# EasyEDA Pro project rtl_sdr_v1.eprj, board PCB2
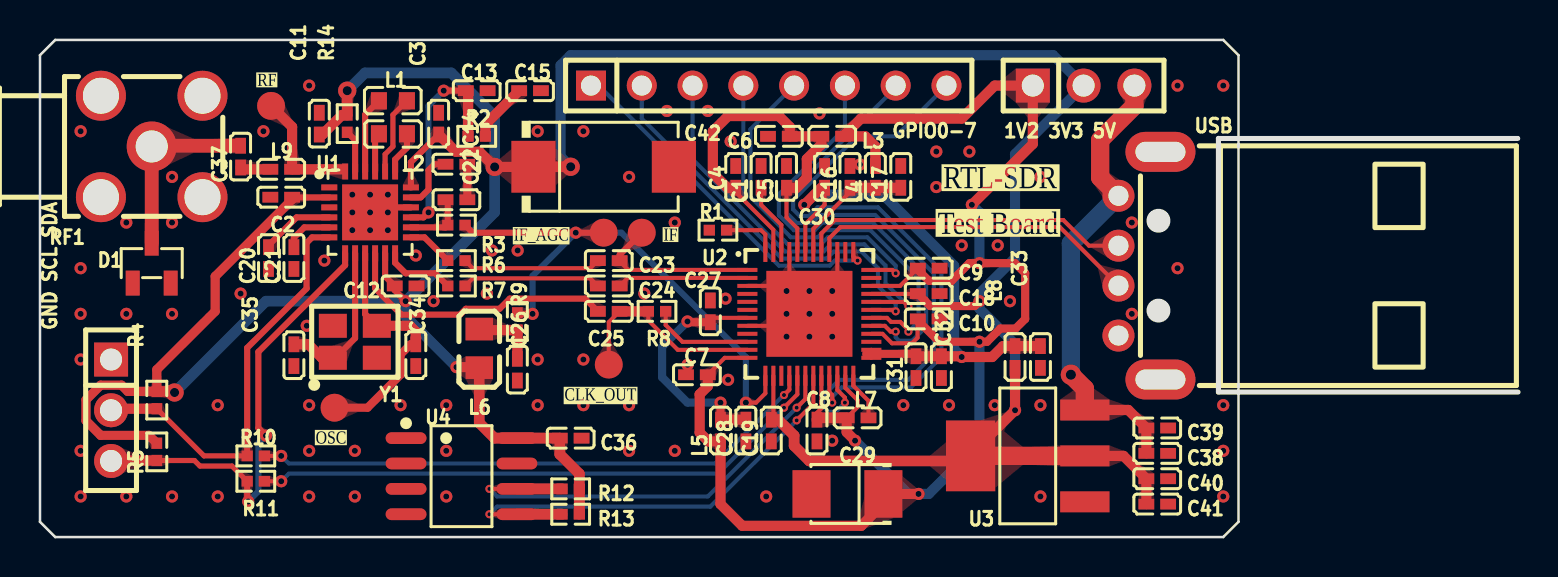
[diagram p5: board, top side]
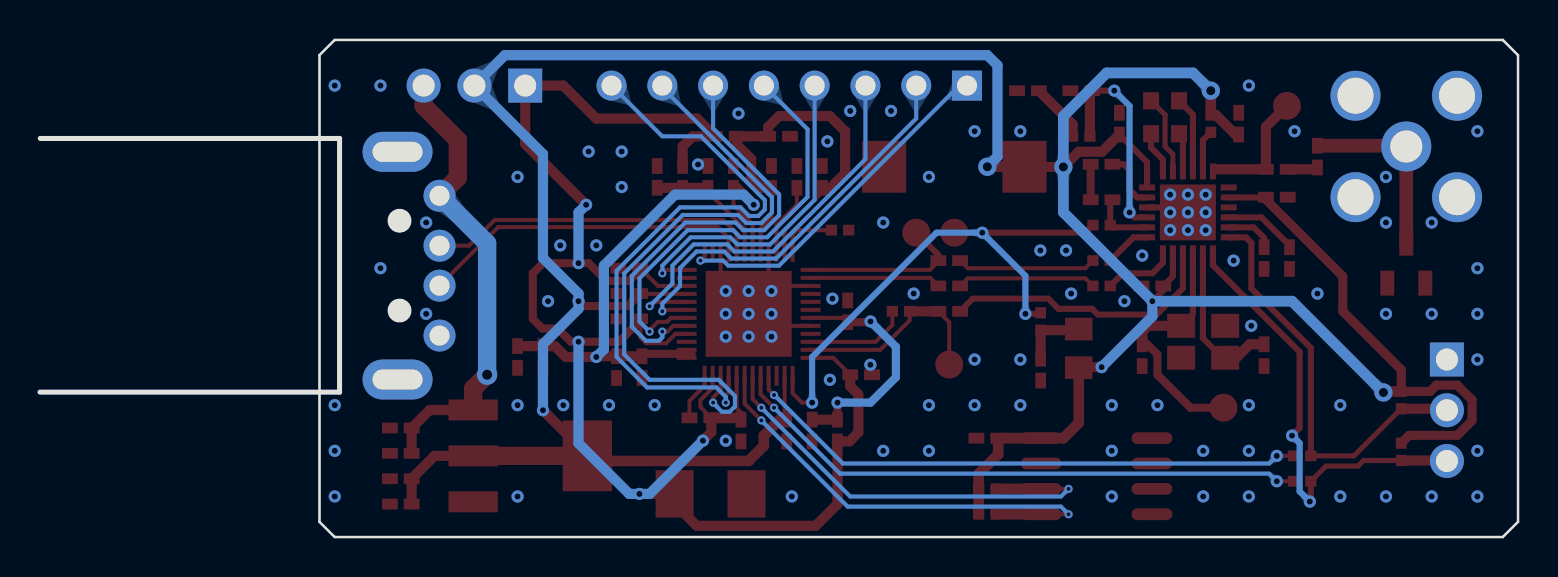
[diagram p6: board, bottom side, seen from below]

Outline 73.92 x 24.89 mm; copper layers: Top Layer, Bottom Layer. Coordinates in mm from the lower left corner of the outline.
Outline path: 0,24.13 0,0.76 0.76,0 59.18,0 59.94,0.76 59.94,24.13 59.18,24.89 0.76,24.89 0,24.13
Stack: Top Layer 0.035mm / Dielectric1 1.51mm FR4 er 4.5 / Bottom Layer 0.035mm

## Design rules (mm)
spacing safeClearance (default): track to track 0.152, other pairs 0.102 to 0.3
track width trackWidth (default): min 0.127, default 0.254, max 2.54
differential pair differentialPair (default): width min 0.127, default 0.254, max 2.54; gap min 0.152, default 0.152
via viaSize (default): diameter min 0.406, default 0.61, max 10; hole min 0.203, default 0.305, max 5.999

## Placement (name value [footprint] x y rotation side)
1V2 3V3 5V  A2541WV-3P  [HDR-TH_3P-P2.54-V-M]  52.2 22.61 0 top
C1  100nF  [C0402]  36.07 18.03 90 top
C2  100nF  [C0402]  12.06 17.02 180 top
C3  100nF  [C0402]  19.94 20.7 90 top
C4  100nF  [C0402]  34.8 18.03 270 top
C5  100nF  [C0402]  37.34 18.03 270 top
C6  2.2uF  [C0402]  36.96 20.07 0 top
C7  100nF  [C0402]  32.86 8.13 180 top
C8  100nF  [C0402]  38.86 5.33 270 top
C9  100nF  [C0402]  44.45 13.46 0 top
C10  100nF  [C0402]  44.45 10.92 0 top
C11  10nF  [C0402]  13.97 20.7 270 top
C12  10nF  [C0402]  18.29 12.57 180 top
C13  330pF  [C0402]  21.84 22.35 180 top
C14  100nF  [C0402]  20.83 18.67 180 top
C15  6.8nF  [C0402]  24.51 22.35 180 top
C16  100nF  [C0402]  40.51 18.03 270 top
C17  2.2uF  [C0402]  43.05 18.03 270 top
C18  100nF  [C0402]  44.45 12.19 0 top
C19  100nF  [C0402]  36.58 5.33 270 top
C20  1uF  [C0402]  11.43 13.97 90 top
C21  100nF  [C0402]  12.7 13.97 270 top
C22  100nF  [C0402]  20.83 16.89 0 top
C23  100nF  [C0402]  28.45 13.84 0 top
C24  100nF  [C0402]  28.45 12.57 0 top
C25  100nF  [C0402]  28.45 11.3 0 top
C26  100nF  [C0402]  23.88 8.38 90 top
C27  100nF  [C0402]  33.53 11.3 270 top
C28  2.2uF  [C0402]  35.31 5.33 90 top
C29  22uF  [CAP-SMD_L3.5-W2.8-FD]  40.39 2.16 180 top
C30  100nF  [C0402]  39.24 18.03 270 top
C31  100nF  [C0402]  43.81 8.51 270 top
C32  10uF  [C0402]  45.08 8.51 270 top
C33  2.2uF  [C0402]  50.04 9.02 90 top
C34  27pF  [C0402]  18.8 9.11 270 top
C35  27pF  [C0402]  12.7 9.11 90 top
C36  100nF  [C0402]  26.54 4.95 0 top
C37  10nF  [C0402]  10.03 19.05 270 top
C38  10uF  [C0402]  55.88 4.19 180 top
C39  100nF  [C0402]  55.88 5.46 180 top
C40  10uF  [C0402]  55.88 2.92 180 top
C41  100nF  [C0402]  55.88 1.65 180 top
C42  220uF  [CAP-SMD_L7.3-W4.3-R-RD]  28.19 18.54 180 top
D1  BAV99LT1G  [SOT-23-3_L2.9-W1.3-P1.90-LS2.4-BR]  5.59 13.72 270 top
GND SCL SDA  A2541WV-3P  [HDR-TH_3P-P2.54-V-M]  3.56 6.35 270 top
GPIO0-7  B-2100S08P-A110  [HDR-TH_8P-P2.54-V-M]  36.45 22.61 0 top
L1  150nH  [L0603]  17.65 21.84 0 top
L2  150nH  [L0603]  17.65 20.19 180 top
L3  26Ω@100MHz  [L0402]  39.62 20.07 0 top
L4  26Ω@100MHz  [L0402]  41.78 18.03 90 top
L5  26Ω@100MHz  [L0402]  34.04 5.33 270 top
L6  1.8uH  [L0805]  21.97 9.45 90 top
L7  4.7uH  [L0402]  40.89 5.97 180 top
L8  26Ω@100MHz  [L0402]  48.77 9.02 270 top
L9  4.7nH  [L0402]  12.06 18.41 0 top
NOREF  -  [Pad_e544]  28.19 15.24 0 top
NOREF#2  -  [Pad_e529]  11.56 21.59 0 top
NOREF#3  -  [Pad_e538]  14.73 6.48 0 top
NOREF#4  -  [Pad_e540]  28.45 8.64 0 top
NOREF#5  -  [Pad_e542]  30.1 15.24 0 top
R1  10kΩ  [R0402]  33.91 15.37 0 top
R2  1.8kΩ  [R0402]  21.84 20.07 180 top
R3  10kΩ  [R0402]  20.83 15.62 0 top
R4  4.7kΩ  [R0402]  5.84 6.86 90 top
R5  4.7kΩ  [R0402]  5.84 4.27 90 top
R6  220Ω  [R0402]  20.83 13.84 0 top
R7  220Ω  [R0402]  20.83 12.57 0 top
R8  1MΩ  [R0402]  30.86 11.3 0 top
R9  1kΩ  [R0402]  23.88 10.79 270 top
R10  220Ω  [R0402]  10.79 4.06 0 top
R11  220Ω  [R0402]  10.79 2.79 0 top
R12  4.7kΩ  [R0402]  26.54 2.41 0 top
R13  4.7kΩ  [R0402]  26.54 1.14 0 top
R14  5.6Ω  [R0402]  15.37 20.7 270 top
RF1  DOSIN-806-0001  [CONN-TH_DOSIN-806-0001]  5.59 19.56 180 top
U1  -  [VQFN-24_L4.0-W4.0-P0.50-TL-EP2.8]  16.51 16.26 0 top
U2  -  [QFN-48_L6.0-W6.0-P0.40-BL-EP4.3]  38.48 11.18 270 top
U3  AMS1117-3.3  [SOT-223_L6.5-W3.5-P2.30-LS7.0-BR]  49.4 4.06 0 top
U4  M24C02-RMN6TP  [SOIC-8_L4.9-W3.9-P1.27-LS6.0-BL]  21.08 3.05 270 top
USB  USB-05  [USB-A-TH_48037-0001]  54.99 13.59 90 top
Y1  -  [28.8MHz]  15.75 9.78 0 top

## Footprints (pads in the part's own frame, mm; a bottom-side part is the same pattern mirrored in y, then rotated)
28.8MHz
  custom 1.4x1.2 smd: 1(-1.1,-0.8)
  rect 1.4x1.2 smd: 2(1.1,-0.8) 3(1.1,0.8) 4(-1.1,0.8)
C0402
  rect 0.79x0.54 smd: 1(-0.545,0) 2(0.545,0)
CAP-SMD_L3.5-W2.8-FD
  rect 1.9x2.376 smd: 1(-1.798,0) 2(1.798,0)
CAP-SMD_L7.3-W4.3-R-RD
  rect 2.208x2.592 smd: 1(3.511,0) 2(-3.511,0)
CONN-TH_DOSIN-806-0001
  round 2.5 hole 1.8: 1(-2.54,-2.54) 2(-2.54,2.54) 3(2.54,2.54) 4(2.54,-2.54)
  round 2.5 hole 1.6: 5(0,0)
HDR-TH_3P-P2.54-V-M
  rect 1.7x1.7 hole 1.1: 1(-2.54,0)
  round 1.7 hole 1.1: 2(0,0) 3(2.54,0)
HDR-TH_8P-P2.54-V-M
  rect 1.5x1.5 hole 1: 1(-8.89,0)
  round 1.5 hole 1: 2(-6.35,0) 3(-3.81,0) 4(-1.27,0) 5(1.27,0) 6(3.81,0) 7(6.35,0) 8(8.89,0)
L0402
  rect 0.79x0.54 smd: 1(-0.545,0) 2(0.545,0)
L0603
  rect 0.8x0.864 smd: 1(-0.7,0) 2(0.7,0)
L0805
  rect 1.133x1.377 smd: 1(-0.966,0) 2(0.966,0)
Pad_e529
  round 1.397 smd: RF(0,0)
Pad_e538
  round 1.397 smd: OSC(0,0)
Pad_e540
  round 1.397 smd: CLKOUT(0,0)
Pad_e542
  round 1.397 smd: IF(0,0)
Pad_e544
  round 1.397 smd: IFAGC(0,0)
QFN-48_L6.0-W6.0-P0.40-BL-EP4.3
  rect 0.2x1 smd: 1(-2.2,-3.1) 2(-1.8,-3.1) 3(-1.4,-3.1) 4(-1,-3.1) 5(-0.6,-3.1) 6(-0.2,-3.1) 7(0.2,-3.1) 8(0.6,-3.1) 9(1,-3.1) 10(1.4,-3.1) 11(1.8,-3.1) 12(2.2,-3.1) 25(2.2,3.1) 26(1.8,3.1) 27(1.4,3.1) 28(1,3.1) 29(0.6,3.1) 30(0.2,3.1) 31(-0.2,3.1) 32(-0.6,3.1) 33(-1,3.1) 34(-1.4,3.1) 35(-1.8,3.1) 36(-2.2,3.1)
  rect 1x0.2 smd: 13(3.1,-2.2) 14(3.1,-1.8) 15(3.1,-1.4) 16(3.1,-1) 17(3.1,-0.6) 18(3.1,-0.2) 19(3.1,0.2) 20(3.1,0.6) 21(3.1,1) 22(3.1,1.4) 23(3.1,1.8) 24(3.1,2.2) 37(-3.1,2.2) 38(-3.1,1.8) 39(-3.1,1.4) 40(-3.1,1) 41(-3.1,0.6) 42(-3.1,0.2) 43(-3.1,-0.2) 44(-3.1,-0.6) 45(-3.1,-1) 46(-3.1,-1.4) 47(-3.1,-1.8) 48(-3.1,-2.2)
  rect 4.3x4.3 smd: 49(-0.002,0.002)
R0402
  rect 0.566x0.54 smd: 1(-0.433,0) 2(0.433,0)
SOIC-8_L4.9-W3.9-P1.27-LS6.0-BL
  oval 0.588x2.045 smd: 1(-1.905,-2.772) 2(-0.635,-2.772) 3(0.635,-2.772) 4(1.905,-2.772) 5(1.905,2.772) 6(0.635,2.772) 7(-0.635,2.772) 8(-1.905,2.772)
SOT-23-3_L2.9-W1.3-P1.90-LS2.4-BR
  rect 1.25x0.7 smd: 1(1,-0.95) 2(1,0.95) 3(-1,0)
SOT-223_L6.5-W3.5-P2.30-LS7.0-BR
  rect 2.465x1.05 smd: 1(2.857,-2.3) 2(2.857,0) 3(2.857,2.3)
  rect 2.465x3.54 smd: 4(-2.857,0)
USB-A-TH_48037-0001
  round 1.6 hole 1: 1(3.5,1.05) 2(1,1.05) 3(-1,1.05) 4(-3.5,1.05)
  oval 2x3.5 hole 1x2.5: 5(-5.7,-1.05) 6(5.7,-1.05)
VQFN-24_L4.0-W4.0-P0.50-TL-EP2.8
  rect 0.8x0.3 smd: 1(-2.042,1.25) 2(-2.042,0.75) 3(-2.042,0.25) 4(-2.042,-0.25) 5(-2.042,-0.75) 6(-2.042,-1.25) 13(2.042,-1.25) 14(2.042,-0.75) 15(2.042,-0.25) 16(2.042,0.25) 17(2.042,0.75) 18(2.042,1.25)
  rect 0.3x0.8 smd: 7(-1.25,-2.048) 8(-0.75,-2.048) 9(-0.25,-2.048) 10(0.249,-2.048) 11(0.75,-2.048) 12(1.25,-2.048) 19(1.25,2.048) 20(0.75,2.048) 21(0.249,2.048) 22(-0.25,2.048) 23(-0.75,2.048) 24(-1.25,2.048)
  rect 2.8x2.8 smd: 25(-0.001,-0.001)

## Nets
1V2: 1V2 3V3 5V.1 C7.1 C8.1 C9.1 C10.1 C29.1 L3.2 L4.2 L5.2 L7.2 U2.12 U2.20 U2.23 U2.28 U2.34
3V3: 1V2 3V3 5V.2 C2.1 C3.1 C11.2 C12.2 C18.1 C19.1 C36.1 C40.2 C41.2 C42.1 L6.1 L8.2 R4.2 R5.2 R12.2 R13.2 R14.1 U1.2 U1.11 U1.18 U2.14 U2.33 U3.2 U3.4 U4.8
5V: 1V2 3V3 5V.3 C38.2 C39.2 U3.3 USB.1
GND: C1.2 C2.2 C3.2 C4.1 C5.1 C6.1 C7.2 C8.2 C9.2 C10.2 C11.1 C12.1 C13.1 C14.1 C15.1 C16.1 C17.1 C18.2 C19.2 C20.1 C21.2 C22.2 C26.1 C27.1 C28.1 C29.2 C30.1 C31.2 C32.2 C33.1 C34.2 C35.1 C36.2 C38.1 C39.1 C40.1 C41.1 C42.2 D1.1 D1.2 GND SCL SDA.1 R1.1 RF1.1 RF1.2 RF1.3 RF1.4 U1.16 U1.25 U2.3 U2.8 U2.39 U2.45 U2.49 U3.1 U4.1 U4.2 U4.3 U4.4 U4.7 USB.4 Y1.2 Y1.4
VDD_PLL: C27.2 C28.2 L5.1 U2.7
VDDA12: C4.2 C5.2 C6.2 L3.1 U2.44 U2.47
VDDA33: C30.2 C31.1 C32.1 C33.2 L8.1 U2.25 U2.26 U2.43
CLK_OUT: C25.2 NOREF#4.CLKOUT R8.1 U2.11
GPIO0: GPIO0-7.1 U2.37
GPIO1: GPIO0-7.2 U2.31
GPIO2: GPIO0-7.3 U2.32
GPIO3: GPIO0-7.4 U2.36
GPIO4: GPIO0-7.5 U2.30
GPIO5: GPIO0-7.6 U2.29
GPIO6: GPIO0-7.7 U2.22
GPIO7: GPIO0-7.8 U2.21
IF_AGC: NOREF.IFAGC R3.2 R9.1 U2.13
IF_IN: C24.2 U2.2
IF_IP: C23.2 NOREF#5.IF U2.1
RF_IN: L9.2 NOREF#2.RF U1.24
ROM_SCL: R12.1 U2.18 U4.6
ROM_SDA: R13.1 U2.19 U4.5
T_SCL: GND SCL SDA.2 R4.1 R10.1 U1.6
T_SDA: GND SCL SDA.3 R5.1 R11.1 U1.7
USB_DM: U2.41 USB.2
USB_DP: U2.40 USB.3
UVDDA: C16.2 C17.2 L4.1 U2.42
XTAL_I: C35.2 U1.8 Y1.1
XTAL_O: C34.1 NOREF#3.OSC U1.9 Y1.3
$1N1594: C37.1 D1.3 RF1.5
$1N1930: C37.2 L9.1
$1N6838: C21.1 U1.5
$1N6851: C20.2 U1.4
$1N11372: L1.1 U1.22
$1N11392: L1.2 U1.20
$1N12305: L2.1 U1.19
$1N12306: L2.2 U1.21
$1N15211: C23.1 R6.2
$1N15347: C24.1 R7.2
$1N15700: C22.1 R3.1 U1.14
$1N16619: C13.2 R2.2 U1.15
$1N16902: C14.2 U1.17
$1N17181: C15.2 R2.1
$1N18448: R6.1 U1.13
$1N18481: R7.1 U1.12
$1N21853: C25.1 U1.10
$1N26222: R8.2 U2.10
$1N27944: R10.2 U2.16
$1N27983: R11.2 U2.17
$1N40591: R1.2 U2.48
$1N40849: C1.1 U2.46
$1N44263: C26.2 L6.2 R9.2
$1N51858: L7.1 U2.24
$1N92956: R14.2 U1.23

Pads without a net: U1 1 3; U2 4 5 6 9 15 27 35 38; USB 5 6

## Via types
v1: diameter 0.61, hole 0.305, Top Layer to Bottom Layer, 116 vias
v2: diameter 1.016, hole 0.508, Top Layer to Bottom Layer, 1 via
v3: diameter 0.914, hole 0.457, Top Layer to Bottom Layer, 4 vias
v4: diameter 0.406, hole 0.203, Top Layer to Bottom Layer, 14 vias

## Routing (per net, layer and track width the routed paths; a pad name or vN(x,y) marks a point on that pad's centre or on a via; arc(x,y) is an arc through that point)
1V2: length 86.9
  Top Layer w0.203: U2.28 42.14,10.18 42.61,9.7 43.61,9.7 43.89,9.98 43.89,10.83 43.9,10.84 ; U2.12 34.25,8.98 C7.1 ; U2.34 43.02,12.58 43.87,13.42 ; U2.20 39.08,6.44 38.86,6.22 C8.1 ; L7.2 40.89,6.51 40.89,6.86 40.28,7.47 U2.23
  Top Layer w0.406: 43.9,13.46 43.87,13.42 44.46,12.83 45.59,12.83 46.48,13.72 v1(46.99,13.72) 48.77,13.72 49.28,13.21 49.28,10.92 48.79,10.44 48.03,10.44 47.37,9.78 v1(46.99,9.78) 44.97,9.78 43.9,10.84
  Top Layer w0.508: C7.1 33.4,7.55 32.99,7.15 32.99,5.23 33.44,4.79 L5.2 34.04,1.65 35.12,0.56 41.08,0.56 42.18,1.67 C29.1 v1(43.94,2.16) ; L7.2 40.35,5.25 40.77,4.83 v1(40.77,4.83) ; v1(46.61,16.64) 49.66,19.68 1V2 3V3 5V.1 47.75,22.61 46.1,20.95 41.06,20.95 L3.2 41.27,20.07 41.78,19.56 L4.2
  Top Layer w0.533: L7.2 38.95,5.97 C8.1
  Bottom Layer w0.508: v1(46.61,16.64) 46.99,16.26 v1(46.99,13.72) ; v1(46.99,9.78) 46.99,4.7 44.45,2.16 v1(43.94,2.16) 43.43,2.16 v1(40.77,4.83)
3V3: length 177.1
  Top Layer w0.203: U2.33 43.89,12.18 43.9,12.19 ; U2.14 36.68,5.98
  Top Layer w0.305: C2.1 12.62,17.01 U1.2 ; v1(18.29,11.81) 17.74,12.36 C12.2 17.26,13.05 U1.11 ; C3.1 18.55,18.77 U1.18
  Top Layer w0.406: 43.9,12.19 44.24,11.85 44.24,11.85 44.53,11.57 46.75,11.57 v1(46.99,11.81)
  Top Layer w0.457: R5.2 5.45,5.09 3.04,5.09 2.3,5.83 2.3,6.87 3.04,7.61 4.08,7.61 4.39,7.29 R4.2 5.84,8.38 8.76,11.3 8.76,13.05 12.62,16.91 12.62,17.01
  Top Layer w0.508: C42.1 24.67,18.53 v3(22.74,18.53) 21.98,19.29 20.8,19.29 C3.1 ; L8.2 v1(48.77,6.35) 46.55,4.13 U3.4 ; R14.1 15.1,21.13 14.13,20.16 C11.2 ; C41.2 C40.2 54.19,4.06 U3.2 ; 21.97,8.51 v1(20.83,8.51)
  Top Layer w0.533: R4.2 6.68,7.29 v3(6.73,7.24) ; v3(15.37,22.35) R14.1 ; U3.4 46.29,3.81 38.48,3.81 37.72,4.57 37.72,5.08 36.92,5.88 C19.1 ; R13.2 R12.2 26.98,3.17 26,4.14 C36.1 U4.8 22.73,4.95 21.97,5.71 21.97,8.51 ; v3(26.54,18.54) C42.1
  Top Layer w0.914: U3.4 U3.2
  Bottom Layer w0.508: v3(26.54,18.54) 26.03,19.05 26.03,23.62 26.54,24.13 50.67,24.13 1V2 3V3 5V.2 48.77,19.18 48.77,13.97 46.99,12.19 v1(46.99,11.81) 46.99,11.43 48.77,9.65 v1(48.77,6.35) ; v1(20.83,8.51) 18.29,11.05 v1(18.29,11.81)
  Bottom Layer w0.533: v3(15.37,22.35) 16.26,23.24 20.57,23.24 22.74,21.07 v3(22.74,18.53) 22.74,16.26 v1(18.29,11.81) 11.3,11.81 v3(6.73,7.24)
5V: length 23.3
  Top Layer w0.508: U3.3 54.43,6.36 C39.2 C38.2
  Top Layer w0.914: USB.1 53.03,18 53.03,19.88 54.74,21.59 1V2 3V3 5V.3 ; U3.3 52.26,7.43 v2(51.56,8.13)
  Bottom Layer w0.914: USB.1 51.56,14.71 v2(51.56,8.13)
GND: length 11.4
  Top Layer w0.203: U2.8 36.74,10.58 v1(37.34,11.18) ; U2.45 37.48,12.46 v1(37.34,12.32) 37.08,12.58 U2.3 ; U2.39 39.88,12.58 v1(39.63,12.32)
  Top Layer w0.305: U1.16 17.65,16.51 v1(17.4,16.26)
  Top Layer w0.406: C14.1 C22.2
  vias: v1(2.03,20.32) v1(2.03,13.46) v1(2.03,11.18) v1(2.03,8.89) v1(2.03,4.32) v1(2.03,2.03) v1(4.32,15.75) v1(4.32,11.18) v1(4.32,2.03) v1(6.6,18.03) v1(6.6,15.75) v1(6.6,11.18) v1(6.6,2.03) v1(8.89,6.6) v1(8.89,2.03) v1(10.03,12.19) v1(11.18,20.32) v1(13.34,10.58) v1(13.46,22.61) v1(13.46,6.6) v1(13.46,4.32) v1(13.46,2.03) v1(14.22,13.84) v1(15.62,17.14) v1(15.62,16.26) v1(15.62,15.37) v1(15.75,4.32) v1(15.75,2.03) v1(16.51,17.14) v1(16.51,16.26) v1(16.51,15.37) v1(17.4,17.14) v1(17.4,15.37) v1(18.03,6.6) v1(18.8,14.1) v1(19.68,11.81) v1(20.32,6.6) v1(20.32,4.32) v1(20.32,2.03) v1(22.35,12.19) v1(22.61,14.35) v1(23.89,14.35) v1(24.89,20.32) v1(24.89,8.89) v1(24.89,6.6) v1(27.18,20.32) v1(27.18,8.89) v1(27.18,6.6) v1(29.46,18.03) v1(29.46,6.6) v1(29.46,4.32) v1(30.23,12.19) v1(31.36,21.34) v1(31.75,15.75) v1(31.75,4.32) v1(32.39,8.63) v1(33.4,21.34) v1(34.29,11.94) v1(34.42,7.87) v1(34.54,19.81) v1(36.32,2.03) v1(37.34,10.03) v1(38.48,12.32) v1(38.48,11.18) v1(38.48,10.03) v1(38.99,21.21) v1(39.63,11.18) v1(39.63,10.03) v1(39.62,4.83) v1(41.01,18.66) v1(43.18,6.6) v1(44.83,19.3) v1(44.83,17.53) v1(45.47,6.6) v1(46.1,14.6) v1(46.48,19.3) v1(47.75,6.6) v1(47.9,14.6) v1(48.51,11.81) v1(50.04,18.03) v1(50.04,6.6) v1(50.04,2.03) v1(54.61,15.75) v1(54.61,11.18) v1(56.9,22.61) v1(56.9,13.46) v1(59.18,22.61) v1(59.18,6.6) v1(59.18,4.32) v1(59.18,2.03)
VDD_PLL: length 12
  Top Layer w0.203: U2.7 33.75,10.98 C27.2
  Top Layer w0.406: v1(32.39,10.79) 32.42,10.76 C27.2 ; v1(34.04,6.73) L5.1
  Top Layer w0.508: L5.1 C28.2
  Bottom Layer w0.406: v1(32.39,10.79) 31.11,9.52 31.11,8 32.39,6.73 v1(34.04,6.73)
VDDA12: length 21
  Top Layer w0.203: U2.47 36.68,15.39 34.8,17.27 C4.2 ; U2.44 37.88,15.46 37.34,16 C5.2
  Top Layer w0.508: C4.2 34.38,17.49 33.65,18.21 33.65,20.32 34.42,21.08 36.96,21.08 37.5,20.54 C6.2 L3.1 39.08,19.65 38.35,18.93 38.35,18 37.85,17.49 C5.2
VDDA33: length 28.2
  Top Layer w0.203: U2.25 U2.26 ; U2.43 38.28,15.67 39.24,16.64 C30.2
  Top Layer w0.406: 41.33,9.17 41.45,9.17 ; C31.1 43.69,9.17 41.58,9.17
  Top Layer w0.508: C33.2 L8.1 48.17,9.56 47.62,9.02 v1(46.1,9.02) 46.06,9.05 C32.1 C31.1 ; C30.2 39.08,17.49 v1(38.23,16.64)
  Bottom Layer w0.508: v1(46.1,9.02) 45.72,9.4 45.72,13.59 42.16,17.14 38.73,17.14 v1(38.23,16.64)
CLK_OUT: length 10.3
  Top Layer w0.203: C25.2 28.45,10.76 NOREF#4.CLKOUT ; R8.1 30.43,10.85 31.9,9.38 U2.11
  Top Layer w0.508: C25.2 R8.1
GPIO0: length 17.7
  Top Layer w0.203: U2.37 40.68,14.06 v4(40.89,13.84)
  Bottom Layer w0.203: GPIO0-7.1 27.95,22.61 36.96,13.59 39.5,13.59 39.75,13.84 v4(40.89,13.84)
GPIO1: length 20.6
  Top Layer w0.203: U2.31 42.73,11.38 v4(42.8,11.3)
  Bottom Layer w0.203: GPIO0-7.2 30.1,20.95 37.11,13.94 39.34,13.94 39.7,14.3 41.08,14.3 41.91,13.47 41.91,12.57 42.8,11.68 v4(42.8,11.3)
GPIO2: length 20.3
  Top Layer w0.203: v4(43.43,11.56) 43.21,11.78 U2.32
  Bottom Layer w0.203: v4(43.43,11.56) 42.29,12.7 42.29,13.6 41.23,14.66 39.55,14.66 39.2,14.3 37.26,14.3 32.64,18.92 GPIO0-7.3
GPIO3: length 16.7
  Top Layer w0.203: v4(42.8,13.21) 42.63,13.38 U2.36
  Bottom Layer w0.203: v4(42.8,13.21) 42.8,13.59 41.38,15.01 39.4,15.01 39.05,14.66 37.41,14.66 35.18,16.88 GPIO0-7.4
GPIO4: length 21.9
  Top Layer w0.203: v4(43.43,10.29) 43.43,10.37 43.03,10.77 42.57,10.77 42.36,10.98 U2.30
  Bottom Layer w0.203: v4(43.43,10.29) 43.94,10.79 43.94,12.95 41.53,15.37 39.26,15.37 38.9,15.01 37.55,15.01 35.53,17.03 35.53,20.42 GPIO0-7.5
GPIO5: length 22.9
  Top Layer w0.203: U2.29 42.26,10.58 42.55,10.29 v4(42.8,10.29)
  Bottom Layer w0.203: v4(42.8,10.29) 42.8,10 42.97,9.83 43.62,9.83 44.32,10.53 44.32,13.08 41.65,15.75 39.13,15.75 38.75,15.37 37.7,15.37 36.96,16.11 36.96,17.16 40.26,20.46 GPIO0-7.6
GPIO6: length 31.5
  Top Layer w0.203: U2.22 39.88,7.36 40.26,6.98 v4(40.26,6.73)
  Bottom Layer w0.203: GPIO0-7.7 42.8,22.5 37.31,17.02 37.31,16.26 37.85,15.72 38.61,15.72 39.01,16.13 41.77,16.13 44.7,13.2 44.7,9.14 43.43,7.87 39.98,7.87 39.17,7.06 39.17,6.54 39.43,6.27 39.81,6.27 40.08,6.54 40.08,6.55 v4(40.26,6.73)
GPIO7: length 31.9
  Top Layer w0.203: U2.21 39.48,7.26 39.62,7.11 v4(39.62,6.73)
  Bottom Layer w0.203: GPIO0-7.8 42.8,20.07 40.87,20.07 37.67,16.87 37.67,16.41 38,16.08 38.46,16.08 38.89,16.51 41.91,16.51 45.08,13.33 45.08,9.02 43.56,7.49 40.1,7.49 39.62,7.02 v4(39.62,6.73)
IF_AGC: length 28.3
  Top Layer w0.203: v1(35.31,6.73) 35.81,6.73 36.28,7.2 U2.13
  Top Layer w0.305: NOREF.IFAGC v1(26.8,15.24) 21.64,15.24 R3.2 ; v1(24.64,11.18) 23.93,11.18 R9.1
  Bottom Layer w0.305: v1(24.64,11.18) 24.64,13.08 v1(26.8,15.24) 29.08,15.24 35.31,9.02 v1(35.31,6.73)
IF_IN: length 6.6
  Top Layer w0.203: U2.2 29.4,12.98 C24.2
IF_IP: length 8.4
  Top Layer w0.203: 28.99,13.81 29.42,13.38 U2.1
  Top Layer w0.305: C23.2 28.99,14.13 NOREF#5.IF
RF_IN: length 6.2
  Top Layer w0.508: NOREF#2.RF 12.61,20.54 L9.2 15.15,18.41
ROM_SCL: length 22.8
  Top Layer w0.203: v4(22.48,2.41) U4.6 ; v4(37.85,6.48) 38.28,6.91 U2.18
  Top Layer w0.533: U4.6 R12.1
  Bottom Layer w0.203: v4(22.48,2.41) 22.86,2.03 33.4,2.03 v4(37.85,6.48)
ROM_SDA: length 23.5
  Top Layer w0.203: v4(37.85,5.84) 38.68,6.68 U2.19 ; v4(22.48,1.14) U4.5
  Top Layer w0.533: U4.5 R13.1
  Bottom Layer w0.203: v4(22.48,1.14) 22.86,1.52 33.53,1.52 v4(37.85,5.84)
T_SCL: length 21
  Top Layer w0.254: R4.1 8.2,4.06 R10.1
  Top Layer w0.305: U1.6 13.61,15.01 13.33,14.73 13.33,12.45 10.36,9.47 R10.1
  Top Layer w0.508: R4.1 3.63,6.42 GND SCL SDA.2
T_SDA: length 23
  Top Layer w0.254: 5.84,3.83 7.72,3.83 8,3.56 9.6,3.56 R11.1
  Top Layer w0.305: v1(10.41,1.78) 10.36,1.83 R11.1 ; v1(11.3,5.08) 10.92,5.46 10.92,9.27 15.26,13.61 U1.7
  Top Layer w0.508: 5.84,3.83 3.58,3.83 GND SCL SDA.3
  Bottom Layer w0.305: v1(11.3,5.08) 10.92,4.7 10.92,2.29 v1(10.41,1.78)
USB_DM: length 16.6
  Top Layer w0.203: USB.2 52.47,14.59 51.18,15.88 39.75,15.88 39.08,15.2 U2.41
USB_DP: length 16.6
  Top Layer w0.203: U2.40 39.48,14.97 40.03,15.52 51.01,15.52 53.94,12.59
UVDDA: length 6.5
  Top Layer w0.203: C16.2 40.51,17.27 38.68,15.44 U2.42
  Top Layer w0.508: C16.2 L4.1 C17.2
XTAL_I: length 8
  Top Layer w0.305: Y1.1 14.78,8.98 15.76,9.96 U1.8
  Top Layer w0.508: C35.2 13.42,9.65 14.09,8.98 Y1.1
XTAL_O: length 12.6
  Top Layer w0.305: Y1.3 16.26,11.17 U1.9
  Top Layer w0.406: C34.1 18.54,9.65 18.03,9.14 18.03,8.13 16.38,6.48 NOREF#3.OSC
  Top Layer w0.508: Y1.3 18.5,10.58 18.8,10.29 C34.1
$1N1594: length 9.2
  Top Layer w0.686: D1.3 RF1.5 5.62,19.59 9.94,19.59
$1N1930: length 1.5
  Top Layer w0.508: C37.2 10.12,18.41 L9.1
$1N6838: length 2.5
  Top Layer w0.305: C21.1 12.7,14.99 13.22,15.51 U1.5
$1N6851: length 3.7
  Top Layer w0.305: U1.4 12.83,16.01 11.43,14.6 C20.2
$1N11372: length 3.8
  Top Layer w0.305: U1.22 16.26,21.15 L1.1
$1N11392: length 4
  Top Layer w0.254: U1.20 17.26,19.17 17.65,19.56 17.65,21.14 L1.2
$1N12305: length 2.1
  Top Layer w0.305: U1.19 17.76,18.9 18.35,19.5 L2.1
$1N12306: length 2
  Top Layer w0.305: L2.2 16.76,20 U1.21
$1N15211: length 7
  Top Layer w0.203: C23.1 27.52,13.46 21.64,13.46 R6.2
$1N15347: length 7
  Top Layer w0.203: R7.2 21.64,12.95 27.52,12.95 C24.1
$1N15700: length 3.2
  Top Layer w0.305: U1.14 20.28,15.51 R3.1 20.39,16.78 C22.1
$1N16619: length 10.8
  Top Layer w0.305: v1(20.19,22.35) C13.2 ; U1.15 19.18,16.01 v1(19.43,16.26)
  Top Layer w0.508: C13.2 21.41,22.24 R2.2
  Bottom Layer w0.305: v1(20.19,22.35) 19.43,21.59 v1(19.43,16.26)
$1N16902: length 3
  Top Layer w0.305: U1.17 19.04,17.01 19.43,17.4 19.43,18.37 19.73,18.67 C14.2
$1N17181: length 3
  Top Layer w0.508: C15.2 22.28,20.66 R2.1
$1N18448: length 2.3
  Top Layer w0.305: R6.1 19.23,15.01 U1.13
$1N18481: length 3.6
  Top Layer w0.305: U1.12 17.76,13.74 18.29,13.21 19.76,13.21 R7.1
$1N21853: length 14
  Top Layer w0.305: U1.10 16.76,12.45 18.07,11.14 21.01,11.14 21.3,11.43 22.99,11.43 23.49,11.94 27.27,11.94 C25.1
$1N26222: length 5.1
  Top Layer w0.203: U2.10 32.13,9.78 31.29,10.62 R8.2
$1N27944: length 28.6
  Top Layer w0.203: U2.16 37.48,7.38 v4(37.21,7.11) ; R10.2 v1(12.06,4.06)
  Bottom Layer w0.203: v4(37.21,7.11) 37.2,7.11 33.77,3.68 12.45,3.68 v1(12.06,4.06)
$1N27983: length 29.4
  Top Layer w0.203: R11.2 v1(12.06,2.79) ; v4(37.21,6.48) 37.88,7.15 U2.17
  Bottom Layer w0.203: v1(12.06,2.79) 12.45,3.17 33.91,3.17 v4(37.21,6.48)
$1N40591: length 2.9
  Top Layer w0.203: R1.2 36.07,15.37 36.28,15.15 U2.48
$1N40849: length 3.6
  Top Layer w0.203: C1.1 36.07,16.64 37.08,15.62 U2.46
$1N44263: length 3.4
  Top Layer w0.508: L6.2 22.02,10.36 R9.2 C26.2
$1N51858: length 2.4
  Top Layer w0.203: 41.44,5.97 41.44,6.82 40.68,7.58 U2.24
$1N92956: length 2.1
  Top Layer w0.305: U1.23 15.76,19.87 R14.2

## Copper pours and planes (outline as drawn; the poured copper is in the pictures)
GND on Top Layer: -0.25,25.15 60.2,25.15 60.2,-0.25 -0.25,-0.25
GND on Bottom Layer: -0.25,25.15 60.2,25.15 60.2,-0.25 -0.25,-0.25

Small or netless copper shapes (teardrops, artwork), in the pictures only: 207 on Top Layer, 42 on Bottom Layer

## Text on the board
Top Silkscreen Layer: RF | OSC | IF_AGC | CLK_OUT | IF | Test Board | RTL-SDR
